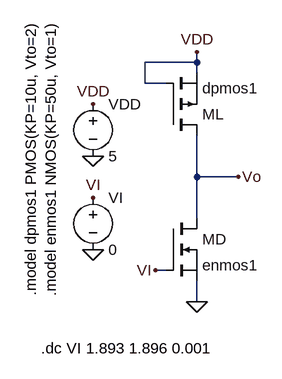
[diagram p0: schematic 18-3-10-a-1.asc]
18-3-10-a-1.asc, the LTspice schematic file:
Version 4
SHEET 1 880 680
WIRE 256 -160 256 -176
WIRE 256 -160 176 -160
WIRE 256 -144 256 -160
WIRE 176 -128 176 -160
WIRE 208 -128 176 -128
WIRE 256 16 256 -48
WIRE 320 16 256 16
WIRE 256 80 256 16
WIRE 208 160 192 160
WIRE 256 208 256 176
FLAG 256 208 0
FLAG 192 160 VI
FLAG 320 16 Vo
FLAG 256 -176 VDD
FLAG 96 -16 0
FLAG 96 -96 VDD
FLAG 96 48 VI
FLAG 96 128 0
SYMBOL nmos 208 80 R0
SYMATTR InstName MD
SYMATTR Value enmos1
SYMBOL pmos 208 -48 M180
SYMATTR InstName ML
SYMATTR Value dpmos1
SYMBOL voltage 96 -112 R0
WINDOW 123 0 0 Left 0
WINDOW 39 0 0 Left 0
SYMATTR InstName VDD
SYMATTR Value 5
SYMBOL voltage 96 32 R0
WINDOW 123 0 0 Left 0
WINDOW 39 0 0 Left 0
SYMATTR InstName VI
SYMATTR Value 0
TEXT 0 -224 VRight 2 !.model dpmos1 PMOS(KP=10u, Vto=2)\n.model enmos1 NMOS(KP=50u, Vto=1)
TEXT 16 280 Left 2 !.dc VI 1.893 1.896 0.001

The netlist it stands for:
* 18-3-10-a-1.asc
MD Vo VI 0 0 enmos1
ML Vo VDD VDD VDD dpmos1
VDD VDD 0 5
VI VI 0 0
.model NMOS NMOS
.model PMOS PMOS
.lib standard.mos
.model dpmos1 PMOS(KP=10u, Vto=2)
.model enmos1 NMOS(KP=50u, Vto=1)
.dc VI 1.893 1.896 0.001
.backanno
.end